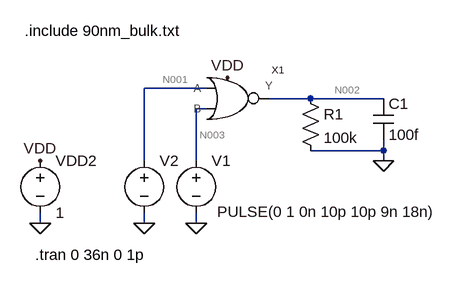
[diagram p0: schematic test_nor.asc]
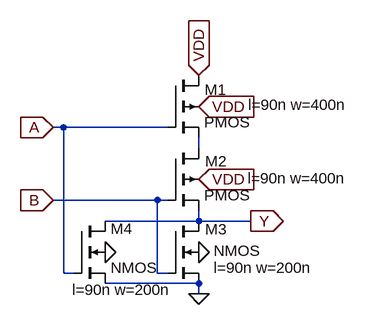
[diagram p1: sub-circuit nor.asc]
test_nor.asc, the LTspice schematic file:
Version 4
SHEET 1 880 680
WIRE 192 80 96 80
WIRE 352 96 288 96
WIRE 464 96 352 96
WIRE 192 112 176 112
WIRE 464 176 464 160
WIRE 464 176 352 176
WIRE 96 192 96 80
WIRE 176 192 176 112
WIRE 464 192 464 176
WIRE -64 288 -64 272
WIRE 96 288 96 272
WIRE 176 288 176 272
FLAG 176 288 0
FLAG -64 288 0
FLAG -64 192 VDD
FLAG 224 64 VDD
FLAG 464 192 0
FLAG 96 288 0
SYMBOL nor 224 96 R0
WINDOW 39 0 0 Left 0
SYMATTR InstName X1
SYMBOL voltage 176 176 R0
WINDOW 123 0 0 Left 0
WINDOW 39 0 0 Left 0
WINDOW 3 32 94 Left 2
SYMATTR Value PULSE(0 1 0n 10p 10p 9n 18n)
SYMATTR InstName V1
SYMBOL voltage -64 176 R0
WINDOW 123 0 0 Left 0
WINDOW 39 0 0 Left 0
SYMATTR InstName VDD2
SYMATTR Value 1
SYMBOL res 336 80 R0
SYMATTR InstName R1
SYMATTR Value 100k
SYMBOL cap 448 96 R0
SYMATTR InstName C1
SYMATTR Value 100f
SYMBOL voltage 96 176 R0
WINDOW 123 0 0 Left 0
WINDOW 39 0 0 Left 0
WINDOW 3 32 94 Invisible 2
SYMATTR Value PULSE(0 1 9n 10p 10p 18n 36n)
SYMATTR InstName V2
TEXT -88 -8 Left 2 !.include 90nm_bulk.txt
TEXT -72 336 Left 2 !.tran 0 36n 0 1p

nor.asc, the sub-circuit schematic file:
Version 4
SHEET 1 880 680
WIRE 16 -176 0 -176
WIRE 176 -176 16 -176
WIRE 224 -144 224 -160
WIRE 160 -64 0 -64
WIRE 176 -64 160 -64
WIRE 224 -32 224 -48
WIRE 224 -32 80 -32
WIRE 304 -32 224 -32
WIRE 16 48 16 -176
WIRE 32 48 16 48
WIRE 160 48 160 -64
WIRE 176 48 160 48
WIRE 224 64 80 64
WIRE 224 80 224 64
FLAG 0 -176 A
IOPIN 0 -176 In
FLAG 0 -64 B
IOPIN 0 -64 In
FLAG 224 -256 VDD
IOPIN 224 -256 In
FLAG 304 -32 Y
IOPIN 304 -32 Out
FLAG 224 -208 VDD
IOPIN 224 -208 In
FLAG 224 -96 VDD
IOPIN 224 -96 In
FLAG 224 16 0
FLAG 80 16 0
FLAG 224 80 0
SYMBOL pmos4 176 -256 R0
WINDOW 123 124 45 Left 2
WINDOW 0 57 22 Left 2
SYMATTR Value2 l=90n w=400n
SYMATTR InstName M1
SYMBOL pmos4 176 -144 R0
WINDOW 123 123 46 Left 2
WINDOW 0 58 20 Left 2
SYMATTR Value2 l=90n w=400n
SYMATTR InstName M2
SYMBOL nmos4 176 -32 R0
WINDOW 123 71 72 Left 2
WINDOW 0 58 13 Left 2
WINDOW 3 71 46 Left 2
SYMATTR Value2 l=90n w=200n
SYMATTR InstName M3
SYMBOL nmos4 32 -32 R0
WINDOW 123 -3 106 Left 2
WINDOW 0 56 12 Left 2
SYMATTR Value2 l=90n w=200n
SYMATTR InstName M4

The netlist it stands for:
* test_nor.asc
XX1 N001 N003 VDD N002 nor
V1 N003 0 PULSE(0 1 0n 10p 10p 9n 18n)
VDD2 VDD 0 1
R1 N002 0 100k
C1 N002 0 100f
V2 N001 0 PULSE(0 1 9n 10p 10p 18n 36n)

* block symbol definitions
.subckt nor A B VDD Y
M1 VDD A N001 VDD PMOS l=90n w=400n
M2 N001 B Y VDD PMOS l=90n w=400n
M3 Y B 0 0 NMOS l=90n w=200n
M4 Y A 0 0 NMOS l=90n w=200n
.ends nor

.model NMOS NMOS
.model PMOS PMOS
.lib standard.mos
.include 90nm_bulk.txt
.tran 0 36n 0 1p
.backanno
.end

* Results of the author's LTspice run, read from the files saved beside the schematic
* Operating Point, zero values left out:
*   V(vdd) = 1 V
*   V(n002) = 921.2 mV
*   I(R1) = 9.212 µA
*   I(Vdd2) = -9.214 µA
*   Ix(x1:VDD) = 9.214 µA
*   Ix(x1:Y) = -9.212 µA
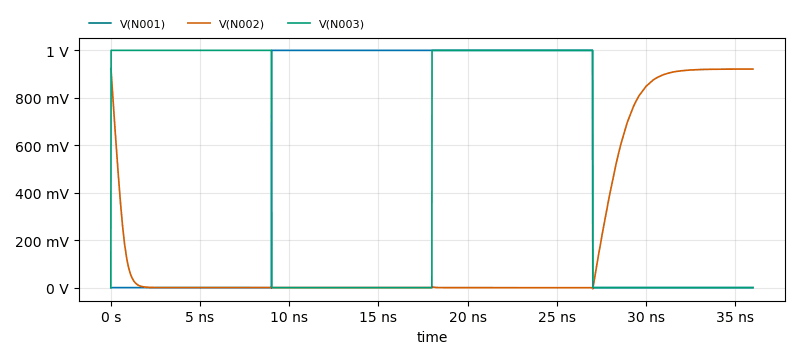
[diagram p2: Transient Analysis of test_nor.asc, plotted from the saved traces]
* Transient Analysis, 1 run:
*   V(N001): min 0 V, max 1 V, average 500.3 mV, rms 707.2 mV, last 0 V
*   V(N002): min -4.976 mV, max 923.3 mV, average 207.6 mV, rms 416.5 mV, last 921.2 mV
*   V(N003): min 0 V, max 1 V, average 500.6 mV, rms 707.4 mV, last 0 V